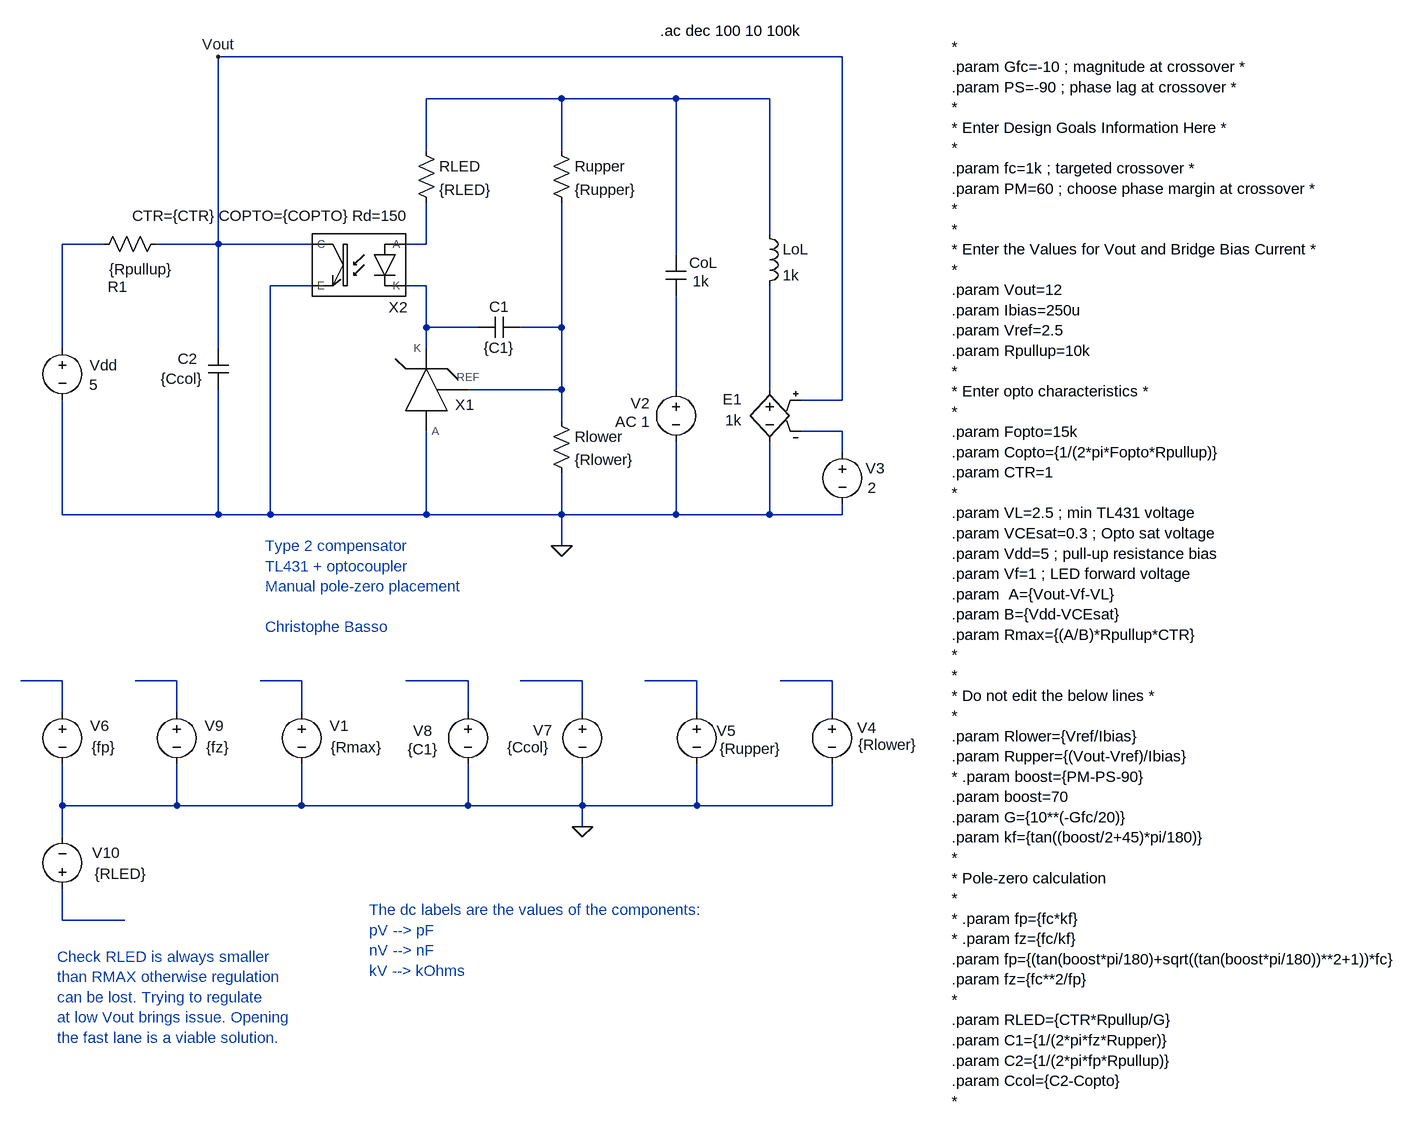
[diagram p0: schematic type 2 - TL431 - manual placement.asc]
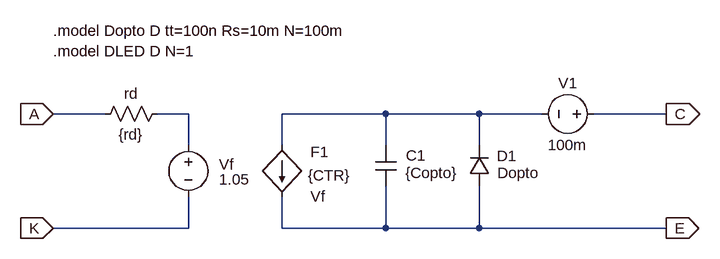
[diagram p1: sub-circuit optotof.asc]
type 2 - TL431 - manual placement.asc, the LTspice schematic file:
Version 4
SHEET 1 1832 1200
WIRE 832 -320 -128 -320
WIRE 400 -256 192 -256
WIRE 576 -256 400 -256
WIRE 720 -256 576 -256
WIRE 192 -176 192 -256
WIRE 400 -176 400 -256
WIRE 720 -48 720 -256
WIRE -304 -32 -368 -32
WIRE -128 -32 -128 -320
WIRE -128 -32 -224 -32
WIRE 16 -32 -128 -32
WIRE 192 -32 192 -96
WIRE 192 -32 160 -32
WIRE 576 -16 576 -256
WIRE 16 32 -48 32
WIRE 192 32 160 32
WIRE 192 96 192 32
WIRE 272 96 192 96
WIRE 400 96 400 -96
WIRE 400 96 336 96
WIRE -368 128 -368 -32
WIRE -128 128 -128 -32
WIRE 192 128 192 96
WIRE 400 192 400 96
WIRE 400 192 256 192
WIRE 576 192 576 48
WIRE 720 192 720 32
WIRE 832 208 832 -320
WIRE 832 208 768 208
WIRE 400 240 400 192
WIRE 832 256 768 256
WIRE 832 288 832 256
WIRE -368 384 -368 208
WIRE -128 384 -128 192
WIRE -128 384 -368 384
WIRE -48 384 -48 32
WIRE -48 384 -128 384
WIRE 192 384 192 256
WIRE 192 384 -48 384
WIRE 400 384 400 320
WIRE 400 384 192 384
WIRE 576 384 576 272
WIRE 576 384 400 384
WIRE 720 384 720 272
WIRE 720 384 576 384
WIRE 832 384 832 368
WIRE 832 384 720 384
WIRE 400 432 400 384
WIRE -368 640 -432 640
WIRE -192 640 -256 640
WIRE 0 640 -64 640
WIRE 256 640 160 640
WIRE 432 640 336 640
WIRE 608 640 528 640
WIRE 816 640 736 640
WIRE -368 688 -368 640
WIRE -192 688 -192 640
WIRE 0 688 0 640
WIRE 256 688 256 640
WIRE 432 688 432 640
WIRE 608 688 608 640
WIRE 816 688 816 640
WIRE -368 832 -368 768
WIRE -192 832 -192 768
WIRE -192 832 -368 832
WIRE 0 832 0 768
WIRE 0 832 -192 832
WIRE 256 832 256 768
WIRE 256 832 0 832
WIRE 432 832 432 768
WIRE 432 832 256 832
WIRE 608 832 608 768
WIRE 608 832 432 832
WIRE 816 832 816 768
WIRE 816 832 608 832
WIRE 432 864 432 832
WIRE -368 880 -368 832
WIRE -368 1008 -368 960
WIRE -272 1008 -368 1008
FLAG -128 -320 Vout
FLAG 432 864 0
FLAG 400 432 0
DATAFLAG 640 -256 ""
DATAFLAG 112 -320 ""
DATAFLAG 176 640 ""
DATAFLAG 368 640 ""
DATAFLAG 544 640 ""
DATAFLAG 768 640 ""
DATAFLAG 336 192 ""
DATAFLAG -48 640 ""
DATAFLAG -416 640 ""
DATAFLAG -240 640 ""
DATAFLAG -272 1008 ""
SYMBOL res 384 224 R0
SYMATTR InstName Rlower
SYMATTR Value {Rlower}
SYMBOL res 384 -192 R0
SYMATTR InstName Rupper
SYMATTR Value {Rupper}
SYMBOL cap 560 -16 R0
WINDOW 0 36 13 Left 2
WINDOW 3 42 41 Left 2
SYMATTR InstName CoL
SYMATTR Value 1k
SYMBOL voltage 576 176 M0
WINDOW 0 40 37 Left 2
WINDOW 123 40 65 Left 2
WINDOW 39 0 0 Left 0
SYMATTR InstName V2
SYMATTR Value2 AC 1
SYMATTR Value ""
SYMBOL ind 704 -64 R0
SYMATTR InstName LoL
SYMATTR Value 1k
SYMBOL e 720 176 M0
WINDOW 0 43 31 Left 2
WINDOW 3 43 63 Left 2
SYMATTR InstName E1
SYMATTR Value 1k
SYMBOL voltage 832 272 R0
WINDOW 0 36 41 Left 2
WINDOW 3 39 71 Left 2
SYMATTR InstName V3
SYMATTR Value 2
SYMBOL voltage 816 672 R0
WINDOW 0 39 40 Left 2
WINDOW 3 40 66 Left 2
WINDOW 123 0 0 Left 0
WINDOW 39 0 0 Left 0
SYMATTR InstName V4
SYMATTR Value {Rlower}
SYMBOL voltage 608 672 R0
WINDOW 0 31 45 Left 2
WINDOW 3 35 72 Left 2
WINDOW 123 0 0 Left 0
WINDOW 39 0 0 Left 0
SYMATTR InstName V5
SYMATTR Value {Rupper}
SYMBOL voltage 432 672 R0
WINDOW 0 -76 44 Left 2
WINDOW 3 -116 70 Left 2
SYMATTR InstName V7
SYMATTR Value {Ccol}
SYMBOL voltage 256 672 R0
WINDOW 0 -84 45 Left 2
WINDOW 3 -93 73 Left 2
WINDOW 123 0 0 Left 0
WINDOW 39 0 0 Left 0
SYMATTR InstName V8
SYMATTR Value {C1}
SYMBOL TL431TOF 176 144 R0
WINDOW 0 75 87 Bottom 2
SYMATTR InstName X1
SYMBOL res 176 -192 R0
SYMATTR InstName RLED
SYMATTR Value {RLED}
SYMBOL cap 336 80 R90
WINDOW 0 0 32 VBottom 2
WINDOW 3 32 32 VTop 2
SYMATTR InstName C1
SYMATTR Value {C1}
SYMBOL optoTOF 48 0 M0
WINDOW 0 -101 81 Bottom 2
WINDOW 39 93 -60 Bottom 2
SYMATTR InstName X2
SYMATTR SpiceLine CTR={CTR} COPTO={COPTO} Rd=150
SYMBOL cap -112 128 M0
WINDOW 0 48 16 Left 2
WINDOW 3 40 47 Left 2
SYMATTR InstName C2
SYMATTR Value {Ccol}
SYMBOL res -208 -48 R90
WINDOW 0 97 75 VBottom 2
WINDOW 3 39 39 VTop 2
SYMATTR InstName R1
SYMATTR Value {Rpullup}
SYMBOL voltage -368 112 R0
WINDOW 0 42 42 Left 2
WINDOW 3 41 72 Left 2
SYMATTR InstName Vdd
SYMATTR Value 5
SYMBOL voltage 0 672 R0
WINDOW 0 43 37 Left 2
WINDOW 3 45 70 Left 2
WINDOW 123 0 0 Left 0
WINDOW 39 0 0 Left 0
SYMATTR InstName V1
SYMATTR Value {Rmax}
SYMBOL voltage -368 672 R0
WINDOW 0 43 37 Left 2
WINDOW 3 45 70 Left 2
WINDOW 123 0 0 Left 0
WINDOW 39 0 0 Left 0
SYMATTR InstName V6
SYMATTR Value {fp}
SYMBOL voltage -192 672 R0
WINDOW 0 43 37 Left 2
WINDOW 3 45 70 Left 2
WINDOW 123 0 0 Left 0
WINDOW 39 0 0 Left 0
SYMATTR InstName V9
SYMATTR Value {fz}
SYMBOL voltage -368 976 M180
WINDOW 0 46 72 Left 2
WINDOW 3 50 39 Left 2
SYMATTR InstName V10
SYMATTR Value {RLED}
TEXT 1000 -336 Left 2 !*\n.param Gfc=-10 ; magnitude at crossover *\n.param PS=-90 ; phase lag at crossover *\n*\n* Enter Design Goals Information Here *\n*\n.param fc=1k ; targeted crossover *\n.param PM=60 ; choose phase margin at crossover *\n*\n*\n* Enter the Values for Vout and Bridge Bias Current *\n*\n.param Vout=12\n.param Ibias=250u\n.param Vref=2.5\n.param Rpullup=10k\n*\n* Enter opto characteristics *\n*\n.param Fopto=15k\n.param Copto={1/(2*pi*Fopto*Rpullup)}\n.param CTR=1\n*\n.param VL=2.5 ; min TL431 voltage\n.param VCEsat=0.3 ; Opto sat voltage\n.param Vdd=5 ; pull-up resistance bias\n.param Vf=1 ; LED forward voltage\n.param  A={Vout-Vf-VL}\n.param B={Vdd-VCEsat}\n.param Rmax={(A/B)*Rpullup*CTR}\n*\n*\n* Do not edit the below lines *\n*\n.param Rlower={Vref/Ibias}\n.param Rupper={(Vout-Vref)/Ibias}\n* .param boost={PM-PS-90}\n.param boost=70\n.param G={10**(-Gfc/20)}\n.param kf={tan((boost/2+45)*pi/180)}\n*\n* Pole-zero calculation\n*\n* .param fp={fc*kf}\n* .param fz={fc/kf}\n.param fp={(tan(boost*pi/180)+sqrt((tan(boost*pi/180))**2+1))*fc}\n.param fz={fc**2/fp}\n*\n.param RLED={CTR*Rpullup/G}\n.param C1={1/(2*pi*fz*Rupper)}\n.param C2={1/(2*pi*fp*Rpullup)}\n.param Ccol={C2-Copto}\n*
TEXT 552 -360 Left 2 !.ac dec 100 10 100k
TEXT -56 432 Left 2 ;Type 2 compensator\nTL431 + optocoupler\nManual pole-zero placement\n \nChristophe Basso
TEXT 104 992 Left 2 ;The dc labels are the values of the components:\npV --> pF\nnV --> nF\nkV --> kOhms
TEXT -376 1064 Left 2 ;Check RLED is always smaller\nthan RMAX otherwise regulation\ncan be lost. Trying to regulate\nat low Vout brings issue. Opening \nthe fast lane is a viable solution.

optotof.asc, the sub-circuit schematic file:
Version 4
SHEET 1 892 680
WIRE -48 32 -128 32
WIRE 80 32 32 32
WIRE 384 32 224 32
WIRE 528 32 384 32
WIRE 624 32 528 32
WIRE 816 32 704 32
WIRE 80 80 80 32
WIRE 224 80 224 32
WIRE 384 80 384 32
WIRE 528 80 528 32
WIRE 80 208 80 160
WIRE 80 208 -128 208
WIRE 224 208 224 160
WIRE 384 208 384 144
WIRE 384 208 224 208
WIRE 528 208 528 144
WIRE 528 208 384 208
WIRE 816 208 528 208
FLAG -128 32 A
IOPIN -128 32 In
FLAG -128 208 K
IOPIN -128 208 In
FLAG 816 32 C
IOPIN 816 32 Out
FLAG 816 208 E
IOPIN 816 208 Out
SYMBOL f 224 80 R0
WINDOW 0 44 11 Left 2
WINDOW 3 40 47 Left 2
WINDOW 38 44 79 Left 2
SYMATTR InstName F1
SYMATTR Value {CTR}
SYMATTR SpiceModel Vf
SYMBOL res 48 16 R90
WINDOW 0 0 56 VBottom 2
WINDOW 3 32 56 VTop 2
SYMATTR InstName rd
SYMATTR Value {rd}
SYMBOL voltage 80 64 R0
WINDOW 0 47 46 Left 2
WINDOW 3 47 69 Left 2
WINDOW 123 0 0 Left 0
WINDOW 39 0 0 Left 0
SYMATTR InstName Vf
SYMATTR Value 1.05
SYMBOL voltage 720 32 R90
WINDOW 0 -32 56 VBottom 2
WINDOW 3 32 56 VTop 2
SYMATTR InstName V1
SYMATTR Value 100m
SYMBOL cap 368 80 R0
WINDOW 0 47 16 Left 2
WINDOW 3 46 43 Left 2
SYMATTR InstName C1
SYMATTR Value {Copto}
SYMBOL diode 512 144 M180
WINDOW 0 43 47 Left 2
WINDOW 3 44 21 Left 2
SYMATTR InstName D1
SYMATTR Value Dopto
TEXT -128 -96 Left 2 !.model Dopto D tt=100n Rs=10m N=100m\n.model DLED D N=1

The netlist it stands for:
* type 2 - TL431 - manual placement.asc
Rlower N005 0 {Rlower}
Rupper N001 N005 {Rupper}
CoL N001 N006 1k
V2 N006 0 AC 1
LoL N001 N007 1k
E1 N007 0 Vout N008 1k
V3 N008 0 2
V4 N015 0 {Rlower}
V5 N014 0 {Rupper}
V7 N013 0 {Ccol}
V8 N012 0 {C1}
XX1 0 N005 N004 TL431TOF  ; pins A REF K
RLED N001 N003 {RLED}
C1 N005 N004 {C1}
XX2 N003 N004 Vout 0 optotof params: CTR={CTR} COPTO={COPTO} Rd=150
C2 Vout 0 {Ccol}
R1 Vout N002 {Rpullup}
Vdd N002 0 5
V1 N011 0 {Rmax}
V6 N009 0 {fp}
V9 N010 0 {fz}
V10 N016 0 {RLED}

* block symbol definitions
.subckt optotof A K C E
F1 N002 E Vf {CTR}
rd N001 A {rd}
Vf N001 K 1.05
V1 C N002 100m
C1 N002 E {Copto}
D1 E N002 Dopto
.model Dopto D tt=100n Rs=10m N=100m
.model DLED D N=1
.ends optotof

.model D D
.lib standard.dio
*
.param Gfc=-10 ; magnitude at crossover *
.param PS=-90 ; phase lag at crossover *
*
* Enter Design Goals Information Here *
*
.param fc=1k ; targeted crossover *
.param PM=60 ; choose phase margin at crossover *
*
*
* Enter the Values for Vout and Bridge Bias Current *
*
.param Vout=12
.param Ibias=250u
.param Vref=2.5
.param Rpullup=10k
*
* Enter opto characteristics *
*
.param Fopto=15k
.param Copto={1/(2*pi*Fopto*Rpullup)}
.param CTR=1
*
.param VL=2.5 ; min TL431 voltage
.param VCEsat=0.3 ; Opto sat voltage
.param Vdd=5 ; pull-up resistance bias
.param Vf=1 ; LED forward voltage
.param  A={Vout-Vf-VL}
.param B={Vdd-VCEsat}
.param Rmax={(A/B)*Rpullup*CTR}
*
*
* Do not edit the below lines *
*
.param Rlower={Vref/Ibias}
.param Rupper={(Vout-Vref)/Ibias}
* .param boost={PM-PS-90}
.param boost=70
.param G={10**(-Gfc/20)}
.param kf={tan((boost/2+45)*pi/180)}
*
* Pole-zero calculation
*
* .param fp={fc*kf}
* .param fz={fc/kf}
.param fp={(tan(boost*pi/180)+sqrt((tan(boost*pi/180))**2+1))*fc}
.param fz={fc**2/fp}
*
.param RLED={CTR*Rpullup/G}
.param C1={1/(2*pi*fz*Rupper)}
.param C2={1/(2*pi*fp*Rpullup)}
.param Ccol={C2-Copto}
*
.ac dec 100 10 100k
* Type 2 compensator
* TL431 + optocoupler
* Manual pole-zero placement
* Christophe Basso
* The dc labels are the values of the components:
* pV --> pF
* nV --> nF
* kV --> kOhms
* Check RLED is always smaller
* than RMAX otherwise regulation
* can be lost. Trying to regulate
* at low Vout brings issue. Opening
* the fast lane is a viable solution.
.backanno
.end